# Altium project HU_revB.PrjPcb (part 4 of 4)
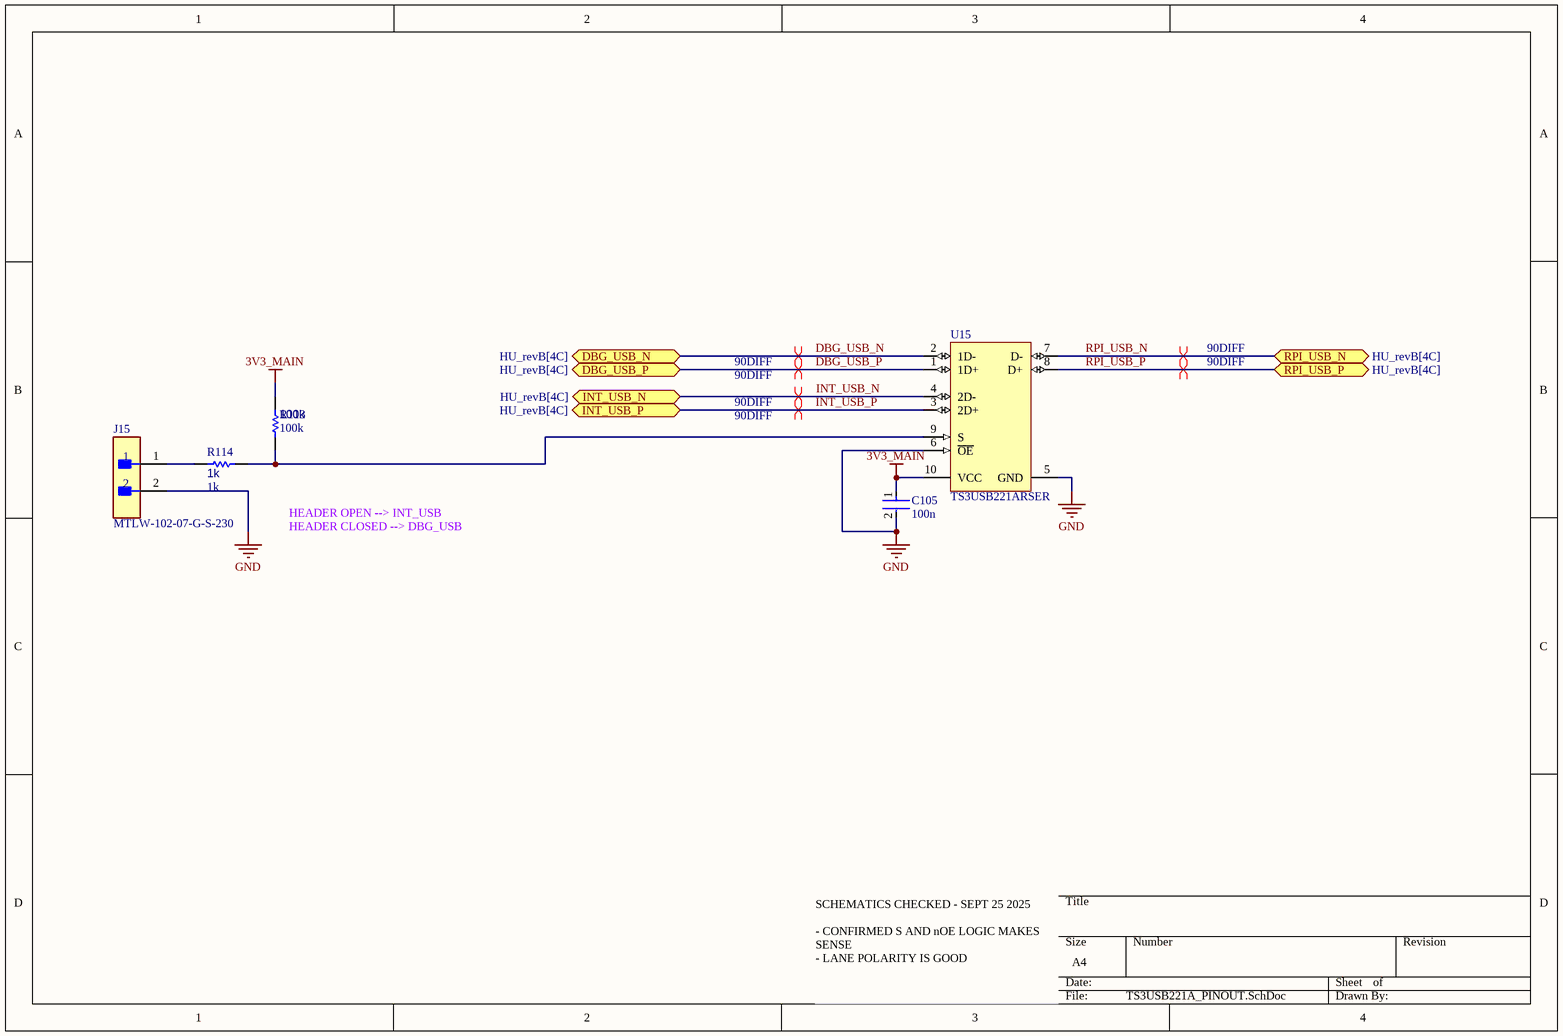
[diagram p26: TS3USB221A_PINOUT.SchDoc]

## Nets that join several sheets
3V3_AUX: HU_revB (R8.1 R9.1), TCAN1146_PWR_MGMT (C2.1 R11.2 U1.8), RPI_CM5_PINOUT (D7.2 D7.3 R27.2), 5V_REG (C10.1 R28.1 R33.2 U4.8), NVME (F10.1), MCP2515_PINOUT (5 pins), TUSB2036_PINOUT (14 pins), 3V3_REG (7 pins), GMSL_DESERIALIZER (13 pins), PWR_SW (C104.1 R108.2 U14.8), MAX_M10M_PINOUT (8 pins), USB (5 pins)
3V3_MAIN: TCAN1146_PWR_MGMT (C4.1 U2.5), RPI_CM5_PINOUT (J8.84 J8.86), SD (Q10.5 Q10.6 R59.2), GMSL_DESERIALIZER (C96.2 C97.2 U11.24), TS3USB221A_PINOUT (C105.1 R113.2 U15.10)
5V_MAIN: HU_revB (9 pins), TCAN1146_PWR_MGMT (C3.1 U2.3), RPI_CM5_PINOUT (6 pins), 5V_REG (R34.2 U4.3 U4.4), DISP_0 (F11_DISP_0.1 Q13_DISP_0.5 Q13_DISP_0.6 R65_DISP_0.2), DISP_1 (F11_DISP_1.1 Q13_DISP_1.5 Q13_DISP_1.6 R65_DISP_1.2)
ACC_12V: HU_revB (J1.24), TCAN1146_PWR_MGMT (R22.1)
AMP_VCC: HU_revB (J19.1 J19.2 J20.1 J20.2), PWR_SW (U14.3 U14.4)
BAT_12V: HU_revB (J1.1 J1.2 J1.13 J1.14), TCAN1146_PWR_MGMT (XF1.1 XF1.2)
GND: HU_revB (154 pins), TCAN1146_PWR_MGMT (17 pins), CM6206_PINOUT (19 pins), RPI_CM5_PINOUT (67 pins), 5V_REG (15 pins), NVME (33 pins), MCP2515_PINOUT (8 pins), SD (9 pins), DISP_0 (13 pins), TUSB2036_PINOUT (23 pins), DISP_1 (13 pins), 3V3_REG (16 pins), GMSL_DESERIALIZER (52 pins), PWR_SW (C104.2 Q16.2 R112.1 U14.5), MAX_M10M_PINOUT (13 pins), USB (15 pins), TS3USB221A_PINOUT (C105.2 J15.2 U15.5 U15.6)
PWR_OUT: HU_revB (F3.1 F5.1 F6.1 F7.1), TCAN1146_PWR_MGMT (R13.2 U1.3 U1.4)
CAM_GPIO0: HU_revB (R145.1), RPI_CM5_PINOUT (J8.97)
CAN_N: HU_revB (J1.29), TCAN1146_PWR_MGMT (C6.1 D4.2 L1.4 R21.2)
CAN_P: HU_revB (J1.28), TCAN1146_PWR_MGMT (C8.2 D4.1 L1.1 R24.1)
CH0_FAN_TACH: HU_revB (R47.2), RPI_CM5_PINOUT (J8.46)
CH0_GPIO: HU_revB (R3.1), RPI_CM5_PINOUT (J8.31)
CH1_FAN_TACH: HU_revB (R132.2), RPI_CM5_PINOUT (J8.48)
CH1_GPIO: HU_revB (R6.1), RPI_CM5_PINOUT (J8.28)
CONF_SCL: RPI_CM5_PINOUT (J8.80), GMSL_DESERIALIZER (U11.29)
CONF_SDA: RPI_CM5_PINOUT (J8.82), GMSL_DESERIALIZER (U11.28)
DIGI_USB_N: DISP_0 (J14_DISP_0.2), TUSB2036_PINOUT (C57.1 R83.1)
DIGI_USB_N: TUSB2036_PINOUT (C51.1 R79.1), DISP_1 (J14_DISP_1.2)
DIGI_USB_P: DISP_0 (J14_DISP_0.3), TUSB2036_PINOUT (C56.1 R82.1)
DIGI_USB_P: TUSB2036_PINOUT (C50.1 R76.1), DISP_1 (J14_DISP_1.3)
DPHY0_CK_N: RPI_CM5_PINOUT (J8.127), GMSL_DESERIALIZER (C121.1)
DPHY0_CK_P: RPI_CM5_PINOUT (J8.129), GMSL_DESERIALIZER (C120.1)
DPHY0_D0_N: RPI_CM5_PINOUT (J8.115), GMSL_DESERIALIZER (C113.1)
DPHY0_D0_P: RPI_CM5_PINOUT (J8.117), GMSL_DESERIALIZER (C112.1)
DPHY0_D1_N: RPI_CM5_PINOUT (J8.121), GMSL_DESERIALIZER (C115.1)
DPHY0_D1_P: RPI_CM5_PINOUT (J8.123), GMSL_DESERIALIZER (C114.1)
DPHY0_D2_N: RPI_CM5_PINOUT (J8.133), GMSL_DESERIALIZER (C117.1)
DPHY0_D2_P: RPI_CM5_PINOUT (J8.135), GMSL_DESERIALIZER (C116.1)
DPHY0_D3_N: RPI_CM5_PINOUT (J8.139), GMSL_DESERIALIZER (C119.1)
DPHY0_D3_P: RPI_CM5_PINOUT (J8.141), GMSL_DESERIALIZER (C118.1)
DPHY1_CK_N: RPI_CM5_PINOUT (J8.187), GMSL_DESERIALIZER (C131.1)
DPHY1_CK_P: RPI_CM5_PINOUT (J8.189), GMSL_DESERIALIZER (C130.1)
DPHY1_D0_N: RPI_CM5_PINOUT (J8.175), GMSL_DESERIALIZER (C123.1)
DPHY1_D0_P: RPI_CM5_PINOUT (J8.177), GMSL_DESERIALIZER (C122.1)
DPHY1_D1_N: RPI_CM5_PINOUT (J8.181), GMSL_DESERIALIZER (C125.1)
DPHY1_D1_P: RPI_CM5_PINOUT (J8.183), GMSL_DESERIALIZER (C124.1)
DPHY1_D2_N: RPI_CM5_PINOUT (J8.193), GMSL_DESERIALIZER (C127.1)
DPHY1_D2_P: RPI_CM5_PINOUT (J8.195), GMSL_DESERIALIZER (C126.1)
DPHY1_D3_N: RPI_CM5_PINOUT (J8.194), GMSL_DESERIALIZER (C129.1)
DPHY1_D3_P: RPI_CM5_PINOUT (J8.196), GMSL_DESERIALIZER (C128.1)
FAN_PWM: HU_revB (R1.2 R134.2), RPI_CM5_PINOUT (J8.19)
FAN_TACHO: HU_revB (R133.2), RPI_CM5_PINOUT (J8.16)
HDMI0_CEC: RPI_CM5_PINOUT (J8.151), DISP_0 (J13_DISP_0.13)
HDMI0_CK_N: RPI_CM5_PINOUT (J8.190), DISP_0 (J13_DISP_0.12)
HDMI0_CK_P: RPI_CM5_PINOUT (J8.188), DISP_0 (J13_DISP_0.10)
HDMI0_D0_N: RPI_CM5_PINOUT (J8.184), DISP_0 (J13_DISP_0.9)
HDMI0_D0_P: RPI_CM5_PINOUT (J8.182), DISP_0 (J13_DISP_0.7)
HDMI0_D1_N: RPI_CM5_PINOUT (J8.178), DISP_0 (J13_DISP_0.6)
HDMI0_D1_P: RPI_CM5_PINOUT (J8.176), DISP_0 (J13_DISP_0.4)
HDMI0_D2_N: RPI_CM5_PINOUT (J8.172), DISP_0 (J13_DISP_0.3)
HDMI0_D2_P: RPI_CM5_PINOUT (J8.170), DISP_0 (J13_DISP_0.1)
HDMI0_HOTP: RPI_CM5_PINOUT (J8.153), DISP_0 (J13_DISP_0.19)
HDMI0_SCL: RPI_CM5_PINOUT (J8.200), DISP_0 (J13_DISP_0.15)
HDMI0_SDA: RPI_CM5_PINOUT (J8.199), DISP_0 (J13_DISP_0.16)
HDMI1_CEC: RPI_CM5_PINOUT (J8.149), DISP_1 (J13_DISP_1.13)
HDMI1_CK_N: RPI_CM5_PINOUT (J8.166), DISP_1 (J13_DISP_1.12)
HDMI1_CK_P: RPI_CM5_PINOUT (J8.164), DISP_1 (J13_DISP_1.10)
HDMI1_D0_N: RPI_CM5_PINOUT (J8.160), DISP_1 (J13_DISP_1.9)
HDMI1_D0_P: RPI_CM5_PINOUT (J8.158), DISP_1 (J13_DISP_1.7)
HDMI1_D1_N: RPI_CM5_PINOUT (J8.154), DISP_1 (J13_DISP_1.6)
HDMI1_D1_P: RPI_CM5_PINOUT (J8.152), DISP_1 (J13_DISP_1.4)
HDMI1_D2_N: RPI_CM5_PINOUT (J8.148), DISP_1 (J13_DISP_1.3)
HDMI1_D2_P: RPI_CM5_PINOUT (J8.146), DISP_1 (J13_DISP_1.1)
HDMI1_HOTP: RPI_CM5_PINOUT (J8.143), DISP_1 (J13_DISP_1.19)
HDMI1_SCL: RPI_CM5_PINOUT (J8.147), DISP_1 (J13_DISP_1.15)
HDMI1_SDA: RPI_CM5_PINOUT (J8.145), DISP_1 (J13_DISP_1.16)
NetC12_1: HU_revB (F3.2), 5V_REG (5 pins)
NetC46_1: CM6206_PINOUT (R?#1.2 R?#2.2), TUSB2036_PINOUT (C46.1 R67.1)
NetC48_1: CM6206_PINOUT (R?#3.2), TUSB2036_PINOUT (C48.1 R73.1)
NetC62_1: HU_revB (F5.2), 3V3_REG (5 pins)
NetF7_2: HU_revB (F7.2), PWR_SW (7 pins)
nETH_G_LED: HU_revB (J6.15), RPI_CM5_PINOUT (J8.17)
nETH_Y_LED: HU_revB (J6.13), RPI_CM5_PINOUT (J8.15)
NetU2_1: TCAN1146_PWR_MGMT (U2.1), MCP2515_PINOUT (U5.1)
NetU2_4: TCAN1146_PWR_MGMT (U2.4), MCP2515_PINOUT (U5.2)
nPWDN: HU_revB (R145.2), GMSL_DESERIALIZER (R93.1 U11.11)
PCIE_CLK_N: RPI_CM5_PINOUT (J8.112), NVME (J10.53)
PCIE_CLK_P: RPI_CM5_PINOUT (J8.110), NVME (J10.55)
PCIE_nCLKREQ: RPI_CM5_PINOUT (J8.102), NVME (R37.2)
PCIE_nRST: RPI_CM5_PINOUT (J8.109), NVME (R36.2)
PCIE_nWAKE: RPI_CM5_PINOUT (J8.104), NVME (R38.2)
PCIE_PWR_EN: RPI_CM5_PINOUT (J8.106), NVME (R45.2)
PCIE_RX0_N: RPI_CM5_PINOUT (J8.118), NVME (J10.43)
PCIE_RX0_P: RPI_CM5_PINOUT (J8.116), NVME (J10.41)
PCIE_TX0_N: RPI_CM5_PINOUT (J8.124), NVME (J10.49)
PCIE_TX0_P: RPI_CM5_PINOUT (J8.122), NVME (J10.47)
PoC_A: HU_revB (J5.2), GMSL_DESERIALIZER (C70.2 D11.1 D11.10 L6.2)
PoC_B: HU_revB (J5.1), GMSL_DESERIALIZER (C71.2 D12.1 D12.10 L9.2)
PoC_C: HU_revB (J5.4), GMSL_DESERIALIZER (C74.2 D13.1 D13.10 L15.2)
PoC_D: HU_revB (J5.3), GMSL_DESERIALIZER (C75.2 D14.1 D14.10 L12.2)
PRE_PoC_PWR: HU_revB (F6.2), GMSL_DESERIALIZER (U18.1 U18.2)
PRE_RC_DBG_USB_N: HU_revB (R140.2), RPI_CM5_PINOUT (J8.103)
PRE_RC_DBG_USB_P: HU_revB (R23.2), RPI_CM5_PINOUT (J8.105)
SD_CLK: RPI_CM5_PINOUT (J8.57), SD (SD1.5)
SD_CMD: RPI_CM5_PINOUT (J8.62), SD (SD1.3)
SD_DAT0: RPI_CM5_PINOUT (J8.63), SD (SD1.7)
SD_DAT1: RPI_CM5_PINOUT (J8.67), SD (SD1.8)
SD_DAT2: RPI_CM5_PINOUT (J8.69), SD (SD1.1)
SD_DAT3: RPI_CM5_PINOUT (J8.61), SD (SD1.2)
SD_PWR_EN: RPI_CM5_PINOUT (J8.75), SD (R60.2)
SPI0_MISO: RPI_CM5_PINOUT (J8.40), MCP2515_PINOUT (U5.15)
SPI0_MOSI: RPI_CM5_PINOUT (J8.44), MCP2515_PINOUT (U5.14)
SPI0_nCS0: RPI_CM5_PINOUT (J8.39), MCP2515_PINOUT (U5.16)
SPI0_SCLK: RPI_CM5_PINOUT (J8.38), MCP2515_PINOUT (U5.13)
SPI3_MISO: TCAN1146_PWR_MGMT (U2.11), RPI_CM5_PINOUT (J8.34)
SPI3_MOSI: TCAN1146_PWR_MGMT (U2.6), RPI_CM5_PINOUT (J8.30)
SPI3_nCS0: TCAN1146_PWR_MGMT (U2.14), RPI_CM5_PINOUT (J8.54)
SPI3_SCLK: TCAN1146_PWR_MGMT (U2.8), RPI_CM5_PINOUT (J8.37)
TRD0_N: HU_revB (J6.10), RPI_CM5_PINOUT (D5.2 D5.9 J8.10)
TRD0_P: HU_revB (J6.11), RPI_CM5_PINOUT (D5.1 D5.10 J8.12)
TRD1_N: HU_revB (J6.5), RPI_CM5_PINOUT (D5.4 D5.7 J8.6)
TRD1_P: HU_revB (J6.4), RPI_CM5_PINOUT (D5.5 D5.6 J8.4)
TRD2_N: HU_revB (J6.2), RPI_CM5_PINOUT (D6.2 D6.9 J8.9)
TRD2_P: HU_revB (J6.3), RPI_CM5_PINOUT (D6.1 D6.10 J8.11)
TRD3_N: HU_revB (J6.9), RPI_CM5_PINOUT (D6.5 D6.6 J8.5)
TRD3_P: HU_revB (J6.8), RPI_CM5_PINOUT (D6.4 D6.7 J8.3)
USB2_CC1: HU_revB (J7.A5), RPI_CM5_PINOUT (J8.94)
USB2_CC2: HU_revB (J7.B5), RPI_CM5_PINOUT (J8.96)
USB3_0_D_N: RPI_CM5_PINOUT (J8.136), TUSB2036_PINOUT (R71.2)
USB3_0_D_P: RPI_CM5_PINOUT (J8.134), TUSB2036_PINOUT (R74.2)
USB3_1_D_N: HU_revB (J6.U2), RPI_CM5_PINOUT (J8.165)
USB3_1_D_P: HU_revB (J6.U3), RPI_CM5_PINOUT (J8.163)
USB_VBUS_EN: HU_revB (R63#1.2), RPI_CM5_PINOUT (J8.111)